# EAGLE schematic schema (EAGLE 9.2.2)
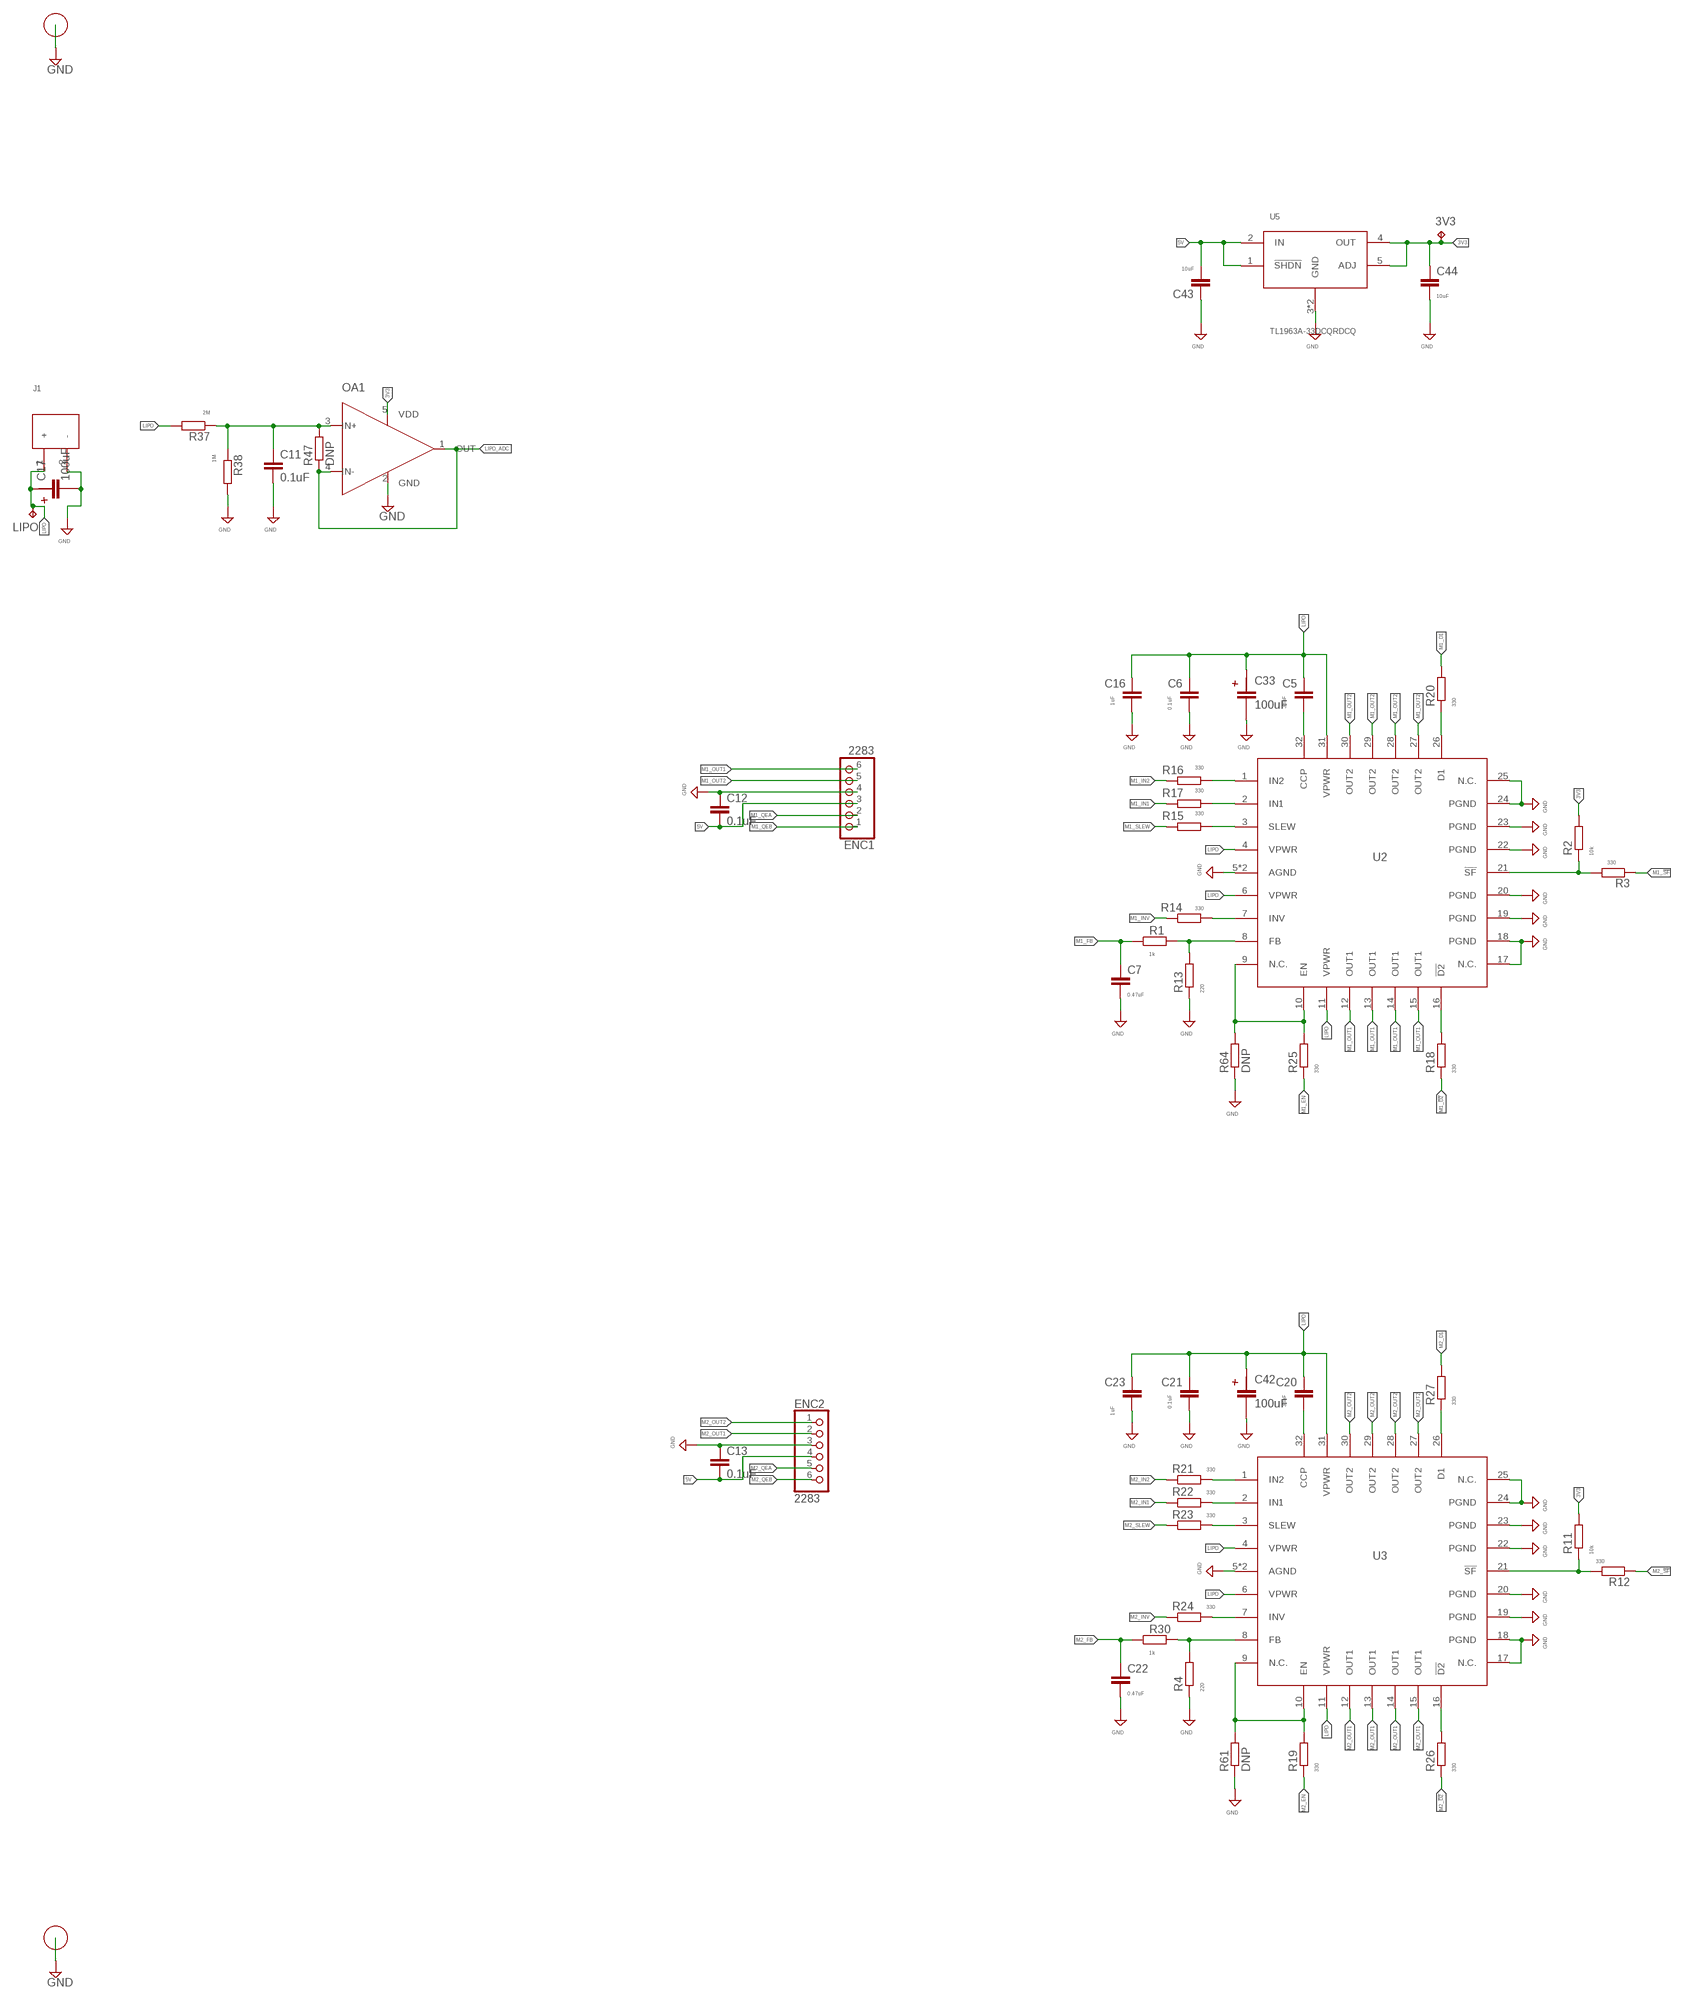
[diagram p0: schematic, sheet 1, part 1 of 2]
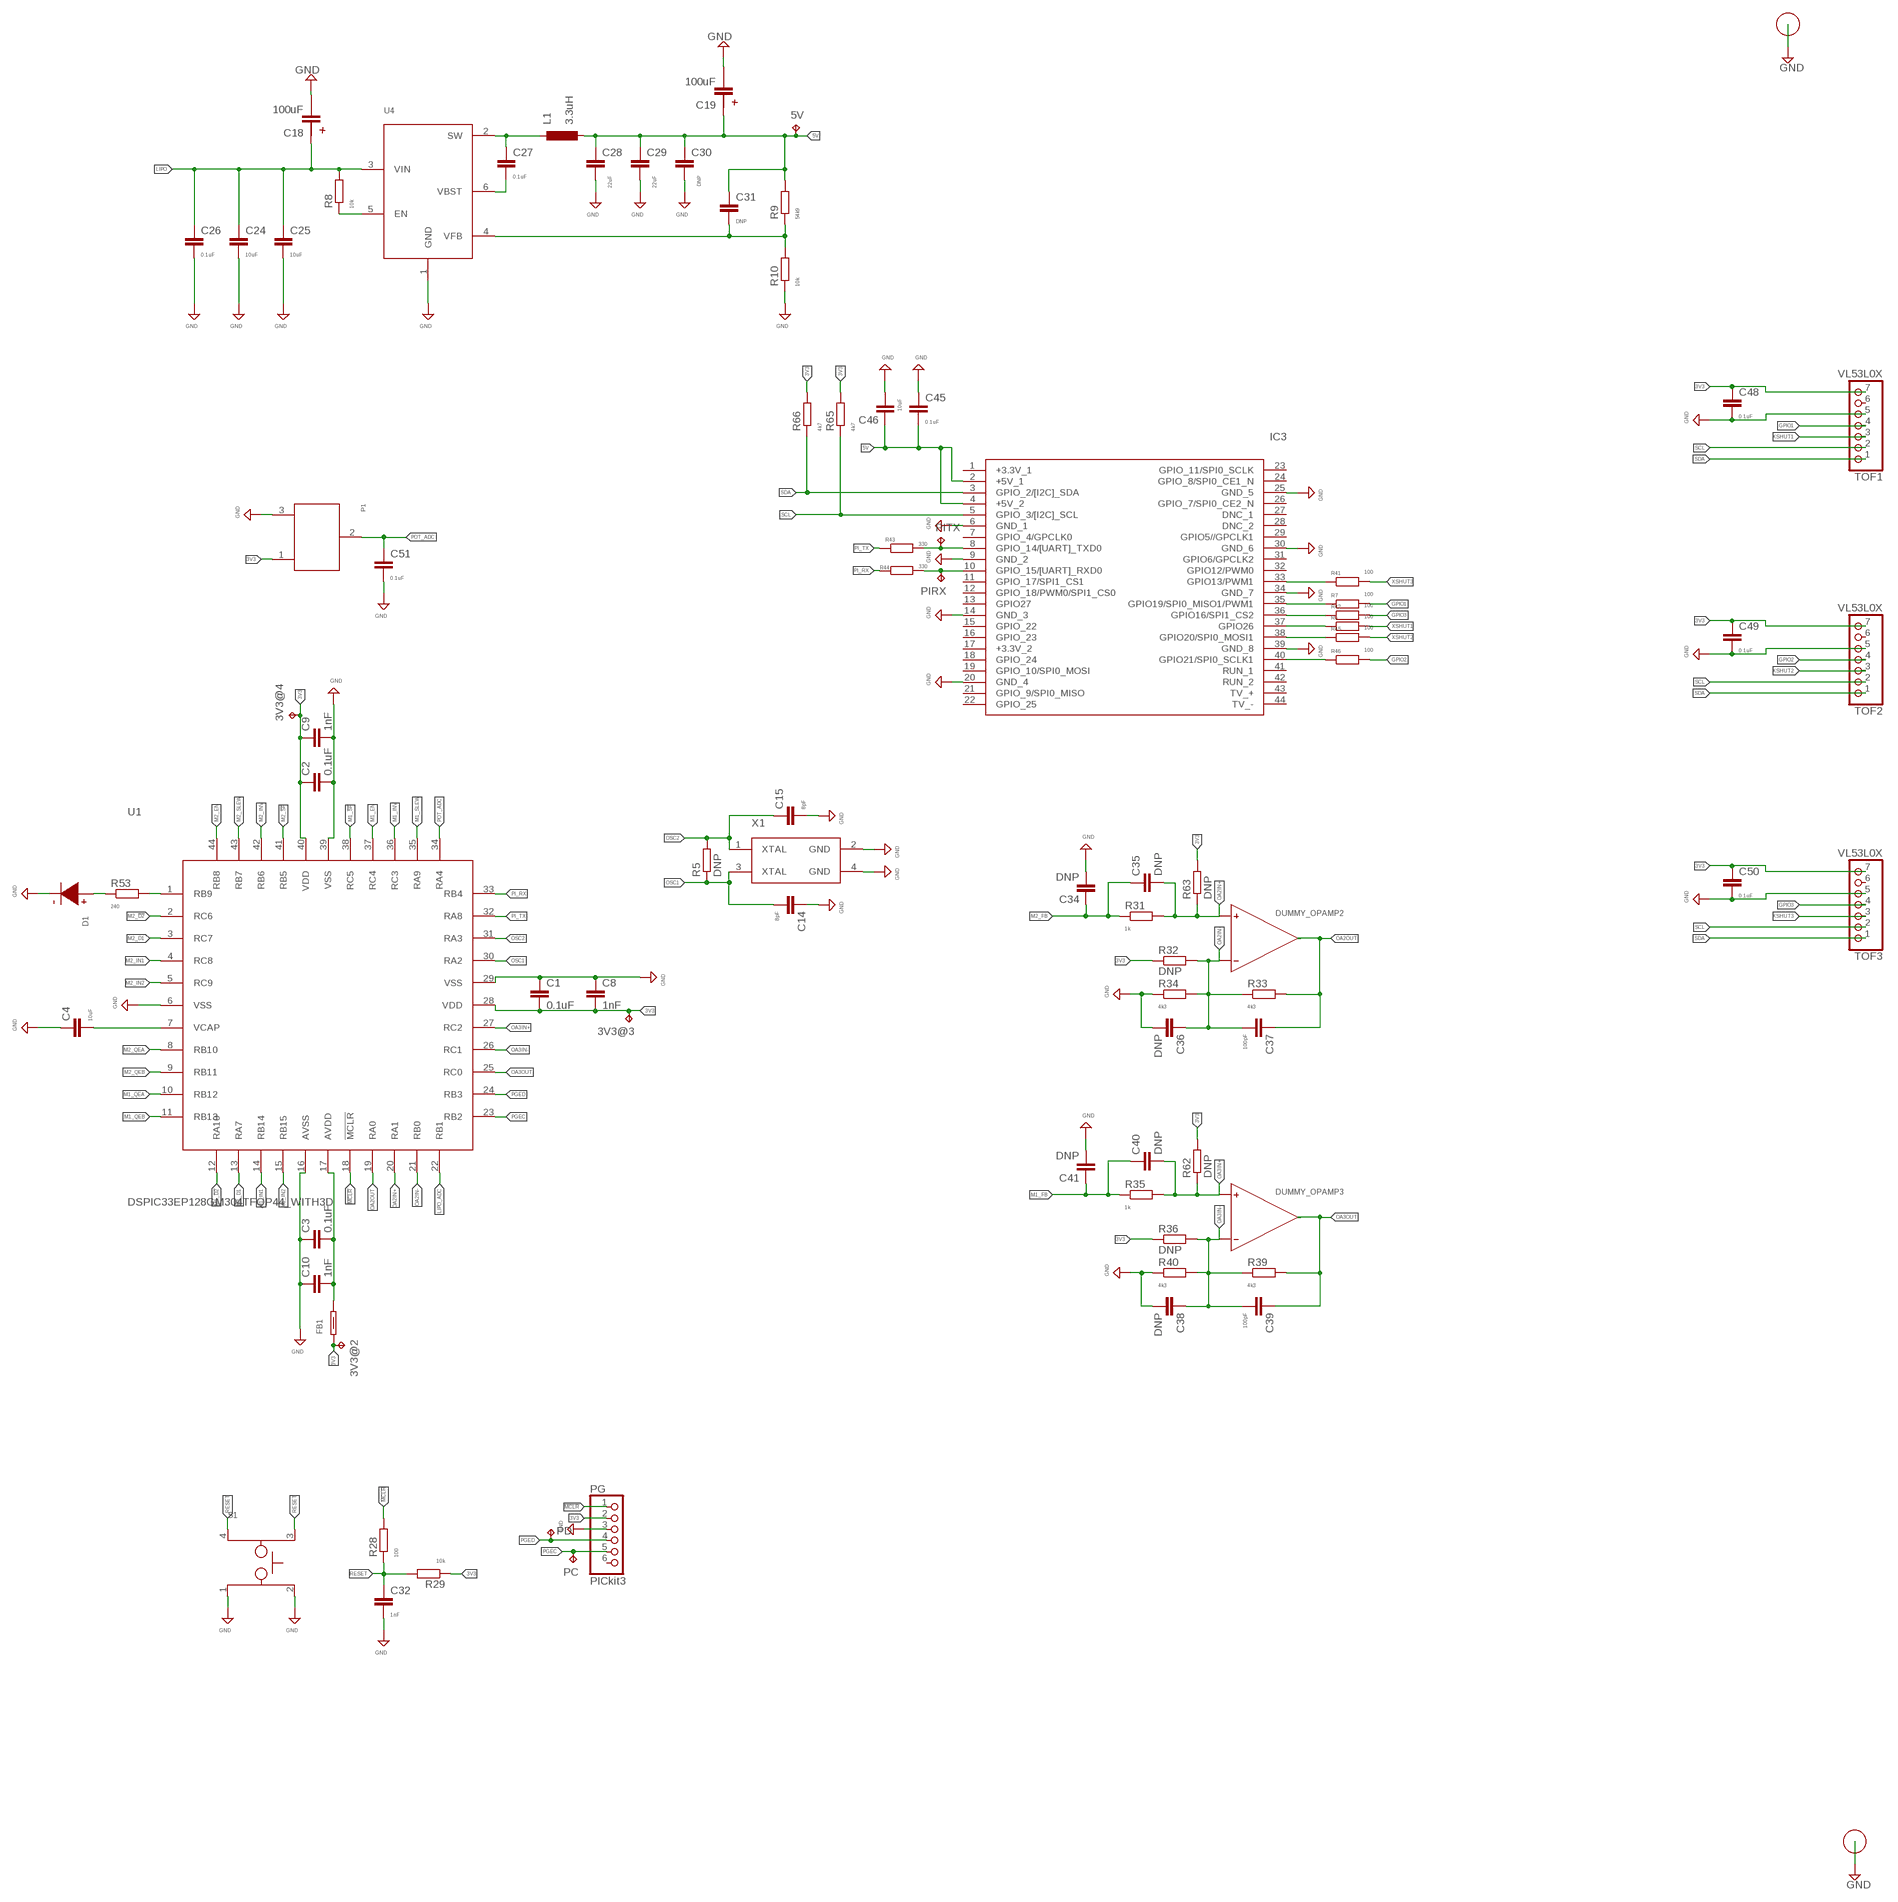
[diagram p1: schematic, sheet 1, part 2 of 2]

## Parts
3V3  TPB1,27  [B1,27]
3V3@2  TPB1,27  [B1,27]
3V3@3  TPB1,27  [B1,27]
3V3@4  TPB1,27  [B1,27]
5V  TPB1,27  [B1,27]
C1  0.1uF  C-EUC0402K  [C0402K]
C2  0.1uF  C-EUC0402K  [C0402K]
C3  0.1uF  C-EUC0402K  [C0402K]
C4  10uF  C-EUC1210K  [C1210K]
C5  33nF  C-EUC0603K  [C0603K]
C6  0.1uF  C-EUC0603K  [C0603K]
C7  0.47uF  C-EUC0603K  [C0603K]
C8  1nF  C-EUC0402K  [C0402K]
C9  1nF  C-EUC0402K  [C0402K]
C10  1nF  C-EUC0402K  [C0402K]
C11  0.1uF  C-EUC0603K  [C0603K]
C12  0.1uF  C-EUC0603K  [C0603K]
C13  0.1uF  C-EUC0603K  [C0603K]
C14  8pF  C-EUC0402K  [C0402K]
C15  8pF  C-EUC0402K  [C0402K]
C16  1uF  C-EUC0603K  [C0603K]
C17  100uF  TANTALUM_2917CASE_X  [CAPMP7141X430]
C18  100uF  WURTH_CAPWE  [CAPAE660X770]
C19  100uF  WURTH_CAPWE  [CAPAE660X770]
C20  33nF  C-EUC0603K  [C0603K]
C21  0.1uF  C-EUC0603K  [C0603K]
C22  0.47uF  C-EUC0603K  [C0603K]
C23  1uF  C-EUC0603K  [C0603K]
C24  10uF  C-EUC1206K  [C1206K]
C25  10uF  C-EUC1206K  [C1206K]
C26  0.1uF  C-EUC0603K  [C0603K]
C27  0.1uF  C-EUC0603K  [C0603K]
C28  22uF  C-EUC1206  [C1206]
C29  22uF  C-EUC1206  [C1206]
C30  DNP  C-EUC1206  [C1206]
C31  DNP  C-EUC0603K  [C0603K]
C32  1nF  C-EUC0603K  [C0603K]
C33  100uF  EEH-ZA1E101XVCAP_D8  [CAPAE660X800]
C34  DNP  C-EUC0603K  [C0603K]
C35  DNP  C-EUC0603K  [C0603K]
C36  DNP  C-EUC0603K  [C0603K]
C37  100pF  C-EUC0603K  [C0603K]
C38  DNP  C-EUC0603K  [C0603K]
C39  100pF  C-EUC0603K  [C0603K]
C40  DNP  C-EUC0603K  [C0603K]
C41  DNP  C-EUC0603K  [C0603K]
C42  100uF  EEH-ZA1E101XVCAP_D8  [CAPAE660X800]
C43  10uF  C-EUC1210K  [C1210K]
C44  10uF  C-EUC1210K  [C1210K]
C45  0.1uF  C-EUC0603K  [C0603K]
C46  10uF  C-EUC1210K  [C1210K]
C48  0.1uF  C-EUC0603K  [C0603K]
C49  0.1uF  C-EUC0603K  [C0603K]
C50  0.1uF  C-EUC0603K  [C0603K]
C51  0.1uF  C-EUC0603K  [C0603K]
D1  LED0805  [LEDC2012X80]
ENC1  2283  PINHD-1X6/90  [1X06/90]
ENC2  2283  PINHD-1X6/90  [1X06/90]
FB1  FERRITE_BEADS0805  [BEADC2012X105]
IC3  RASPBERRY_PI_ZERO_W_(V1.3)NO_HOLE  [PI_0_W]
J1  XT60  [XT60]
L1  3.3uH  WURTH_INDUCTOR7040  [INDDFN700X690X400-2]
LIPO  TPB1,27  [B1,27]
OA1  AMPLIFIERSOT25  [SOT95P285X115-5]
P1  POTENSIOMETER  [PVG3A]
PC  TPB1,27  [B1,27]
PD  TPB1,27  [B1,27]
PG  PICkit3  PINHD-1X6  [1X06]
PIRX  TPB1,27  [B1,27]
PITX  TPB1,27  [B1,27]
R1  1k  R-EU_R0603  [R0603]
R2  10k  R-EU_R0603  [R0603]
R3  330  R-EU_R0603  [R0603]
R4  220  R-EU_R0603  [R0603]
R5  DNP  R-EU_R0402  [R0402]
R6  100  R-EU_R0603  [R0603]
R7  100  R-EU_R0603  [R0603]
R8  10k  R-EU_R0603  [R0603]
R9  54k9  R-EU_R0603  [R0603]
R10  10k  R-EU_R0603  [R0603]
R11  10k  R-EU_R0603  [R0603]
R12  330  R-EU_R0603  [R0603]
R13  220  R-EU_R0603  [R0603]
R14  330  R-EU_R0603  [R0603]
R15  330  R-EU_R0603  [R0603]
R16  330  R-EU_R0603  [R0603]
R17  330  R-EU_R0603  [R0603]
R18  330  R-EU_R0603  [R0603]
R19  330  R-EU_R0603  [R0603]
R20  330  R-EU_R0603  [R0603]
R21  330  R-EU_R0603  [R0603]
R22  330  R-EU_R0603  [R0603]
R23  330  R-EU_R0603  [R0603]
R24  330  R-EU_R0603  [R0603]
R25  330  R-EU_R0603  [R0603]
R26  330  R-EU_R0603  [R0603]
R27  330  R-EU_R0603  [R0603]
R28  100  R-EU_R0603  [R0603]
R29  10k  R-EU_R0603  [R0603]
R30  1k  R-EU_R0603  [R0603]
R31  1k  R-EU_R0603  [R0603]
R32  DNP  R-EU_R0603  [R0603]
R33  4k3  R-EU_R0603  [R0603]
R34  4k3  R-EU_R0603  [R0603]
R35  1k  R-EU_R0603  [R0603]
R36  DNP  R-EU_R0603  [R0603]
R37  2M  R-EU_R0805  [R0805]
R38  1M  R-EU_R0805  [R0805]
R39  4k3  R-EU_R0603  [R0603]
R40  4k3  R-EU_R0603  [R0603]
R41  100  R-EU_R0603  [R0603]
R42  100  R-EU_R0603  [R0603]
R43  330  R-EU_R0603  [R0603]
R44  330  R-EU_R0603  [R0603]
R45  100  R-EU_R0603  [R0603]
R46  100  R-EU_R0603  [R0603]
R47  DNP  R-EU_R0603  [R0603]
R53  240  R-EU_R0603  [R0603]
R61  DNP  R-EU_R0603  [R0603]
R62  DNP  R-EU_R0603  [R0603]
R63  DNP  R-EU_R0603  [R0603]
R64  DNP  R-EU_R0603  [R0603]
R65  4k7  R-EU_R0603  [R0603]
R66  4k7  R-EU_R0603  [R0603]
S1  BUTON_SPST  [BUTON_SMD]
TOF1  VL53L0X  PINHD-1X7/90  [1X07/90]
TOF2  VL53L0X  PINHD-1X7/90  [1X07/90]
TOF3  VL53L0X  PINHD-1X7/90  [1X07/90]
U1  DSPIC33EP128GM304TFQP44_WITH3D  [QFP80P1200X1200X120-44]
U2  NXP_DRIVER  [QFN80P800X800X220-33N]
U3  NXP_DRIVER  [QFN80P800X800X220-33N]
U4  TPS656201TPS565201  [SOT95P280X110-6]
U5  TL1963A-33DCQRDCQ  [SOT127P706X180-6]
U$1  MOUNTING_HOLE  [HOLE_3.5MM]
U$2  MOUNTING_HOLE  [HOLE_3.5MM]
U$3  MOUNTING_HOLE  [HOLE_3.5MM]
U$4  MOUNTING_HOLE  [HOLE_3.5MM]
X1  XTALLECX  [OSCCC250X200X60]

## Nets
3V3: 3V3.TP 3V3@2.TP 3V3@3.TP 3V3@4.TP C1.2 C2.1 C8.2 C9.1 C44.1 C48.1 C49.1 C50.1 FB1.1 OA1.5(VDD) P1.1 PG.2 R2.2 R11.2 R29.1 R32.1 R36.1 R62.2 R63.2 R65.2 R66.2 TOF1.7 TOF2.7 TOF3.7 U1.28(VDD) U1.40(VDD) U5.4(OUT) U5.5(ADJ)
5V: 5V.TP C12.2 C13.2 C19.1(POSITIVE) C28.1 C29.1 C30.1 C31.1 C43.2 C45.2 C46.1 ENC1.3 ENC2.4 IC3.2(+5V_1) IC3.4(+5V_2) L1.2 R9.2 U5.1(!SHDN) U5.2(IN)
!MCLR: PG.1 R28.2 U1.18(!MCLR)
GND: C1.1 C2.2 C3.1 C4.1 C6.1 C7.2 C8.1 C9.2 C10.1 C11.2 C12.1 C13.1 C14.1 C15.2 C16.2 C17.1(NEGATIVE) C18.2(NEGATIVE) C19.2(NEGATIVE) C21.1 C22.2 C23.2 C24.2 C25.2 C26.2 C28.2 C29.2 C30.2 C32.2 C33.2(NEGATIVE) C34.2 C36.2 C38.2 C41.2 C42.2(NEGATIVE) C43.1 C44.2 C45.1 C46.2 C48.2 C49.2 C50.2 C51.2 D1.1(-) ENC1.4 ENC2.3 IC3.6(GND_1) IC3.9(GND_2) IC3.14(GND_3) IC3.20(GND_4) IC3.25(GND_5) IC3.30(GND_6) IC3.34(GND_7) IC3.39(GND_8) J1.2(-) OA1.2(GND) P1.3 PG.3 R4.1 R10.1 R13.1 R34.1 R38.2 R40.1 R61.1 R64.1 S1.1 S1.2 TOF1.5 TOF2.5 TOF3.5 U1.6(VSS) U1.16(AVSS) U1.29(VSS) U1.39(VSS) U2.5(AGND) U2.17(N.C.) U2.18(PGND) U2.19(PGND) U2.20(PGND) U2.22(PGND) U2.23(PGND) U2.24(PGND) U2.25(N.C.) U2.33(AGND) U3.5(AGND) U3.17(N.C.) U3.18(PGND) U3.19(PGND) U3.20(PGND) U3.22(PGND) U3.23(PGND) U3.24(PGND) U3.25(N.C.) U3.33(AGND) U4.1(GND) U5.3(GND) U5.6(GND) U$1.P$1 U$2.P$1 U$3.P$1 U$4.P$1 X1.2(GND) X1.4(GND)
GPIO1: R7.2 TOF1.4
GPIO2: R46.2 TOF2.4
GPIO3: R42.2 TOF3.4
LIPO: C5.2 C6.2 C16.1 C17.2(POSITIVE) C18.1(POSITIVE) C20.2 C21.2 C23.1 C24.1 C25.1 C26.1 C33.1(POSITIVE) C42.1(POSITIVE) J1.1(+) LIPO.TP R8.2 R37.2 U2.4(VPWR) U2.6(VPWR) U2.11(VPWR) U2.31(VPWR) U3.4(VPWR) U3.6(VPWR) U3.11(VPWR) U3.31(VPWR) U4.3(VIN)
LIPO_ADC: OA1.1(OUT) OA1.4(IN-) R47.1 U1.22(RB1)
M1_!D2: R18.1 U1.12(RA10)
M1_!SF: R3.1 U1.38(RC5)
M1_D1: R20.2 U1.13(RA7)
M1_EN: R25.1 U1.37(RC4)
M1_FB: C7.1 C40.1 C41.1 R1.1 R35.1
M1_IN1: R17.2 U1.14(RB14)
M1_IN2: R16.2 U1.15(RB15)
M1_INV: R14.1 U1.36(RC3)
M1_OUT1: ENC1.6 U2.12(OUT1) U2.13(OUT1) U2.14(OUT1) U2.15(OUT1)
M1_OUT2: ENC1.5 U2.27(OUT2) U2.28(OUT2) U2.29(OUT2) U2.30(OUT2)
M1_QEA: ENC1.2 U1.10(RB12)
M1_QEB: ENC1.1 U1.11(RB13)
M1_SLEW: R15.2 U1.35(RA9)
M2_!D2: R26.1 U1.2(RC6)
M2_!SF: R12.1 U1.41(RB5)
M2_D1: R27.2 U1.3(RC7)
M2_EN: R19.1 U1.44(RB8)
M2_FB: C22.1 C34.1 C35.1 R30.1 R31.1
M2_IN1: R22.1 U1.4(RC8)
M2_IN2: R21.1 U1.5(RC9)
M2_INV: R24.1 U1.42(RB6)
M2_OUT1: ENC2.2 U3.12(OUT1) U3.13(OUT1) U3.14(OUT1) U3.15(OUT1)
M2_OUT2: ENC2.1 U3.27(OUT2) U3.28(OUT2) U3.29(OUT2) U3.30(OUT2)
M2_QEA: ENC2.5 U1.8(RB10)
M2_QEB: ENC2.6 U1.9(RB11)
M2_SLEW: R23.1 U1.43(RB7)
N$1: R53.2 U1.1(RB9)
N$2: IC3.33(GPIO13/PWM1) R41.1
N$3: C27.2 U4.6(VBST)
N$4: C31.2 R9.1 R10.2 U4.4(VFB)
N$5: R14.2 U2.7(INV)
N$6: R21.2 U3.1(IN2)
N$7: R8.1 U4.5(EN)
N$8: R22.2 U3.2(IN1)
N$9: C4.2 U1.7(VCAP)
N$10: C27.1 L1.1 U4.2(SW)
N$11: R23.2 U3.3(SLEW)
N$12: R24.2 U3.7(INV)
N$13: R26.2 U3.16(!D2)
N$14: R27.1 U3.26(D1)
N$15: R20.1 U2.26(D1)
N$16: R16.1 U2.1(IN2)
N$17: R17.1 U2.2(IN1)
N$18: R15.1 U2.3(SLEW)
N$19: R18.2 U2.16(!D2)
N$20: R11.1 R12.2 U3.21(!SF)
N$21: IC3.35(GPIO19/SPI0_MISO1/PWM1) R7.1
N$22: R2.1 R3.2 U2.21(!SF)
N$23: R25.2 R64.2 U2.9(N.C.) U2.10(EN)
N$24: R4.2 R30.2 U3.8(FB)
N$25: C5.1 U2.32(CCP)
N$26: R19.2 R61.2 U3.9(N.C.) U3.10(EN)
N$27: IC3.36(GPIO16/SPI1_CS2) R42.1
N$28: IC3.37(GPIO26) R6.1
N$29: IC3.38(GPIO20/SPI0_MOSI1) R45.1
N$30: IC3.40(GPIO21/SPI0_SCLK1) R46.1
N$31: R1.2 R13.2 U2.8(FB)
N$32: C11.1 OA1.3(IN+) R37.1 R38.1 R47.2
N$33: IC3.8(GPIO_14/[UART]_TXD0) PITX.TP R43.2
N$34: IC3.10(GPIO_15/[UART]_RXD0) PIRX.TP R44.2
N$36: D1.2(+) R53.1
N$41: C3.2 C10.2 FB1.2 U1.17(AVDD)
N$50: C20.1 U3.32(CCP)
OA2IN+: C35.2 R31.2 R63.1 U1.20(RA1)
OA2IN-: C36.1 C37.2 R32.2 R33.1 R34.2 U1.21(RB0)
OA2OUT: C37.1 R33.2 U1.19(RA0)
OA3IN+: C40.2 R35.2 R62.1 U1.27(RC2)
OA3IN-: C38.1 C39.2 R36.2 R39.1 R40.2 U1.26(RC1)
OA3OUT: C39.1 R39.2 U1.25(RC0)
OSC1: C14.2 R5.1 U1.30(RA2) X1.3(XTAL)
OSC2: C15.1 R5.2 U1.31(RA3) X1.1(XTAL)
PGEC: PC.TP PG.5 U1.23(RB2)
PGED: PD.TP PG.4 U1.24(RB3)
PI_RX: R44.1 U1.33(RB4)
PI_TX: R43.1 U1.32(RA8)
POT_ADC: C51.1 P1.2 U1.34(RA4)
RESET: C32.1 R28.1 R29.2 S1.3 S1.4
SCL: IC3.5(GPIO_3/[I2C]_SCL) R65.1 TOF1.2 TOF2.2 TOF3.2
SDA: IC3.3(GPIO_2/[I2C]_SDA) R66.1 TOF1.1 TOF2.1 TOF3.1
XSHUT1: R6.2 TOF1.3
XSHUT2: R45.2 TOF2.3
XSHUT3: R41.2 TOF3.3
Unconnected: IC3.1(+3.3V_1) IC3.7(GPIO_4/GPCLK0) IC3.11(GPIO_17/SPI1_CS1) IC3.12(GPIO_18/PWM0/SPI1_CS0) IC3.13(GPIO27) IC3.15(GPIO_22) IC3.16(GPIO_23) IC3.17(+3.3V_2) IC3.18(GPIO_24) IC3.19(GPIO_10/SPI0_MOSI) IC3.21(GPIO_9/SPI0_MISO) IC3.22(GPIO_25) IC3.23(GPIO_11/SPI0_SCLK) IC3.24(GPIO_8/SPI0_CE1_N) IC3.26(GPIO_7/SPI0_CE2_N) IC3.27(DNC_1) IC3.28(DNC_2) IC3.29(GPIO5//GPCLK1) IC3.31(GPIO6/GPCLK2) IC3.32(GPIO12/PWM0) IC3.41(RUN_1) IC3.42(RUN_2) IC3.43(TV_+) IC3.44(TV_-) PG.6 TOF1.6 TOF2.6 TOF3.6

## Library data of the parts
3V3 3V3@2-3V3@4 5V LIPO PC PD PIRX PITX = testpad:TP: Test pad
C1-C3 = rcl:C-EU: CAPACITOR, European symbol; MANUFACTURER_PART_NUMBER: CC0402KRX7R7BB104; SPICEPREFIX: C
C4 C46 = rcl:C-EU: CAPACITOR, European symbol; MANUFACTURER_PART_NUMBER: TAJB106K016TNJ; SPICEPREFIX: C
C5 C20 = rcl:C-EU: CAPACITOR, European symbol; MANUFACTURER_PART_NUMBER: CC0603KRX7R9BB333; SPICEPREFIX: C
C6 C11-C13 C21 C26 C27 C45 C48-C51 = rcl:C-EU: CAPACITOR, European symbol; MANUFACTURER_PART_NUMBER: CC0603KRX7R9BB104; SPICEPREFIX: C
C7 C22 = rcl:C-EU: CAPACITOR, European symbol; MANUFACTURER_PART_NUMBER: TMK107B7474KA-TR; SPICEPREFIX: C
C8-C10 = rcl:C-EU: CAPACITOR, European symbol; MANUFACTURER_PART_NUMBER: AC0402KRX7R7BB102; SPICEPREFIX: C
C14 C15 = rcl:C-EU: CAPACITOR, European symbol; MANUFACTURER_PART_NUMBER: GCM1555C1H8R0DA16D; SPICEPREFIX: C
C16 C23 = rcl:C-EU: CAPACITOR, European symbol; MANUFACTURER_PART_NUMBER: UMK107AB7105KA-T; SPICEPREFIX: C
C17 = licenta:TANTALUM_2917; DATASHEET_URL: https://ro.mouser.com/datasheet/2/212/KEM_T2005_T491-1093550.pdf; MANUFACTURER_NAME: KEMET; MANUFACTURER_PART_NUMBER: T491X107M025AT
C18 C19 = licenta:WURTH_CAP; DATASHEET_URL: https://ro.mouser.com/datasheet/2/445/865080545012-1075142.pdf; MANUFACTURER_NAME: Wurth Electronics; MANUFACTURER_PART_NUMBER: 865080545012
C24 C25 = rcl:C-EU: CAPACITOR, European symbol; MANUFACTURER_PART_NUMBER: GMK316AB7106KL-TR; SPICEPREFIX: C
C28 C29 = rcl:C-EU: CAPACITOR, European symbol; MANUFACTURER_PART_NUMBER: EMK316BB7226ML-T; SPICEPREFIX: C
C30 C31 C34-C36 C38 C40 C41 = rcl:C-EU: CAPACITOR, European symbol; SPICEPREFIX: C
C32 = rcl:C-EU: CAPACITOR, European symbol; MANUFACTURER_PART_NUMBER: 885012206083; SPICEPREFIX: C
C33 C42 = licenta:EEH-ZA1E101XV; DATASHEET_URL: https://ro.mouser.com/datasheet/2/315/ABA0000C1221-1280637.pdf; MANUFACTURER_NAME: Panasonic; MANUFACTURER_PART_NUMBER: EEH-ZA1E101XV
C37 C39 = rcl:C-EU: CAPACITOR, European symbol; MANUFACTURER_PART_NUMBER: 885342206001; SPICEPREFIX: C
C43 C44 = rcl:C-EU: CAPACITOR, European symbol; MANUFACTURER_PART_NUMBER: GRM32DR71E106MA12L; SPICEPREFIX: C
D1 = licenta:LED; DATASHEET_URL: https://ro.mouser.com/datasheet/2/239/Lite-On-LTST-C171GKT-1175279.pdf; MANUFACTURER_NAME: Lite-On; MANUFACTURER_PART_NUMBER: LTST-C171GKT
ENC1 ENC2 PG = pinhead:PINHD-1X6: PIN HEADER
FB1 = licenta:FERRITE_BEADS; DATASHEET_URL: https://ro.mouser.com/datasheet/2/400/eads_automotive_power_mpz2012-j_en-1221219.pdf; MANUFACTURER_NAME: TDK; MANUFACTURER_PART_NUMBER: MPZ2012S102JTD25
IC3 = Raspberry_Pi_Zero_W_(v1.3):RASPBERRY_PI_ZERO_W_(V1.3): Raspberry Pi Zero W (v1.3) Single-board Computers Source: Datasheet <https://cdn.sparkfun.com/assets/learn_tutorials/6/7/6/PiZero_1.pdf>
J1 = licenta:XT60; DATASHEET_URL: -; MANUFACTURER_NAME: SparkFun; MANUFACTURER_PART_NUMBER: PRT-10474
L1 = licenta:WURTH_INDUCTOR; DATASHEET_URL: https://ro.mouser.com/datasheet/2/445/744311330-538550.pdf; MANUFACTURER_NAME: Wurth Electronics; MANUFACTURER_PART_NUMBER: 744311330
OA1 = licenta:AMPLIFIER; DATASHEET_URL: https://ro.mouser.com/datasheet/2/115/TLV27x-335372.pdf; MANUFACTURER_NAME: Diodes Incorporated; MANUFACTURER_PART_NUMBER: TLV271CW5-7
P1 = licenta:POTENSIOMETER; DATASHEET_URL: https://ro.mouser.com/datasheet/2/54/vg3-1084610.pdf; MANUFACTURER_NAME: Bourns; MANUFACTURER_PART_NUMBER: PVG3A203C01R00
R1 R30 R31 R35 = rcl:R-EU_: RESISTOR, European symbol; MANUFACTURER_PART_NUMBER: ERJ-3RBD102V; SPICEPREFIX: R
R2 R8 R10 R11 R29 = rcl:R-EU_: RESISTOR, European symbol; MANUFACTURER_PART_NUMBER: ERJ-3RBD1002V; SPICEPREFIX: R
R3 R12 R14-R27 R43 R44 = rcl:R-EU_: RESISTOR, European symbol; MANUFACTURER_PART_NUMBER: RC0603FR-07330RL; SPICEPREFIX: R
R4 R13 = rcl:R-EU_: RESISTOR, European symbol; MANUFACTURER_PART_NUMBER: UCR03EVPFLR220; SPICEPREFIX: R
R5 R32 R36 R47 R61-R64 = rcl:R-EU_: RESISTOR, European symbol; SPICEPREFIX: R
R6 R7 R28 R41 R42 R45 R46 = rcl:R-EU_: RESISTOR, European symbol; MANUFACTURER_PART_NUMBER: AC0603FR-13100RL; SPICEPREFIX: R
R9 = rcl:R-EU_: RESISTOR, European symbol; MANUFACTURER_PART_NUMBER: ERJ-PB3B5492V; SPICEPREFIX: R
R33 R34 R39 R40 = rcl:R-EU_: RESISTOR, European symbol; MANUFACTURER_PART_NUMBER: AC0603FR-074K3L; SPICEPREFIX: R
R37 = rcl:R-EU_: RESISTOR, European symbol; MANUFACTURER_PART_NUMBER: ERJ-6RED2003V; SPICEPREFIX: R
R38 = rcl:R-EU_: RESISTOR, European symbol; MANUFACTURER_PART_NUMBER: AC0805FR-13100KL; SPICEPREFIX: R
R53 = rcl:R-EU_: RESISTOR, European symbol; MANUFACTURER_PART_NUMBER: ERJ-3RBD2400V; SPICEPREFIX: R
R65 R66 = rcl:R-EU_: RESISTOR, European symbol; MANUFACTURER_PART_NUMBER: SFR03EZPF4701; SPICEPREFIX: R
S1 = licenta:BUTON_SPST; DATASHEET_URL: https://ro.mouser.com/datasheet/2/140/P090002-267756.pdf; MANUFACTURER_NAME: E-Switch; MANUFACTURER_PART_NUMBER: LL3301NF065QG
TOF1-TOF3 = pinhead:PINHD-1X7: PIN HEADER
U1 = licenta:DSPIC33EP128GM304; DATASHEET_URL: http://ww1.microchip.com/downloads/en/DeviceDoc/70000689d.pdf; MANUFACTURER_NAME: Microchip Technology; MANUFACTURER_PART_NUMBER: dsPIC33EP128GM304-E/PT
U2 U3 = licenta:NXP_DRIVER; DATASHEET_URL: https://www.nxp.com/docs/en/data-sheet/MC33926.pdf; MANUFACTURER_NAME: NXP / Freescale; MANUFACTURER_PART_NUMBER: MC33926PNB
U4 = licenta:TPS656201; DATASHEET_URL: http://www.ti.com/lit/ds/symlink/tps565201.pdf; MANUFACTURER_NAME: Texas Instruments; MANUFACTURER_PART_NUMBER: TPS565201DDCT
U5 = licenta:TL1963A-33DCQR; DATASHEET_URL: http://www.ti.com/lit/ds/symlink/tl1963a.pdf; MANUFACTURER_NAME: Texas Instruments; MANUFACTURER_PART_NUMBER: TL1963A-33DCQR
U$1-U$4 = licenta:MOUNTING_HOLE
X1 = licenta:XTALL; DATASHEET_URL: https://ro.mouser.com/datasheet/2/122/ECX-2236-15751.pdf; MANUFACTURER_NAME: ECS; MANUFACTURER_PART_NUMBER: ECS-120-10-36-AGY-TR